# EAGLE design test#3 (EAGLE 9.6.2)
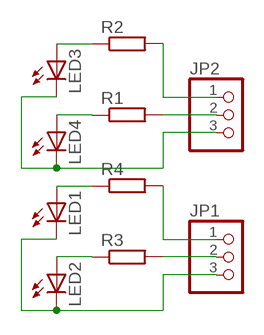
[diagram p0: schematic, sheet 1]

## Parts
JP1  PINHD-1X3  [1X03]
JP2  PINHD-1X3  [1X03]
LED1  LED3MM  [LED3MM]
LED2  LED3MM  [LED3MM]
LED3  LED3MM  [LED3MM]
LED4  LED3MM  [LED3MM]
R1  R-EU_0204/7  [0204/7]
R2  R-EU_0204/7  [0204/7]
R3  R-EU_0204/7  [0204/7]
R4  R-EU_0204/7  [0204/7]

## Nets
N$1: JP1.1 R4.2
N$2: JP1.2 R3.2
N$3: LED1.A R4.1
N$4: LED2.A R3.1
N$5: JP2.1 R2.2
N$6: JP1.3 LED1.K(C) LED2.K(C)
N$7: LED3.A R2.1
N$8: JP2.3 LED3.K(C) LED4.K(C)
N$9: JP2.2 R1.2
N$10: LED4.A R1.1

## Library data of the parts
JP1 JP2 = adafruit:PINHD-1X3: PIN HEADER
LED1-LED4 = adafruit:LED: LED OSRAM: - CHIPLED LG R971, LG N971, LY N971, LG Q971, LY Q971, LO R971, LY R971 LH N974, LH R974 LS Q976, LO Q976, LY Q976 LO Q996 - Hyper CHIPLED LW Q18S LB Q993, LB Q99A, LB R99A - SideLED LS A670, LO A670, LY A670, LG A670, LP A670 LB A673, LV A673, LT A673, LW A673 LH A674 LY A675 LS A676, LA A676, LO A676, LY A676, LW A676 LS A679, LY A679, LG A679 - Hyper Micro SIDELED® LS Y876, LA Y876, LO Y876, LY Y876 LT Y87S - SmartLED LW L88C, LW L88S LB L89C, LB L89S, LG L890 LS L89K, LO L89K, LY L89K LS L896, LA L896, LO L896, LY L896 - TOPLED LS T670, LO T670, LY T670, LG T670, LP T670 LSG T670, LSP T670, LSY T670, LOP T670, LYG T670 LG T671, LOG T671, LSG T671 LB T673, LV T673, LT T673, LW T673 LH T674 LS T676, LA T676, LO T676, LY T676, LB T676, LH T676, LSB T676, LW T676 LB T67C, LV T67C, LT T67C, LS T67K, LO T67K, LY T67K, LW E67C LS E67B, LA E67B, LO E67B, LY E67B, LB E67C, LV E67C, LT E67C LW T67C LS T679, LY T679, LG T679 LS T770, LO T770, LY T770, LG T770, LP T770 LB T773, LV T773, LT T773, LW T773 LH T774 LS E675, LA E675, LY E675, LS T675 LS T776, LA T776, LO T776, LY T776, LB T776 LHGB T686 LT T68C, LB T68C - Hyper Mini TOPLED® LB M676 - Mini TOPLED Santana® LG M470 LS M47K, LO M47K, LY M47K Source: http://www.osram.convergy.de/
R1-R4 = rcl:R-EU_: RESISTOR, European symbol; SPICEPREFIX: R

## Board
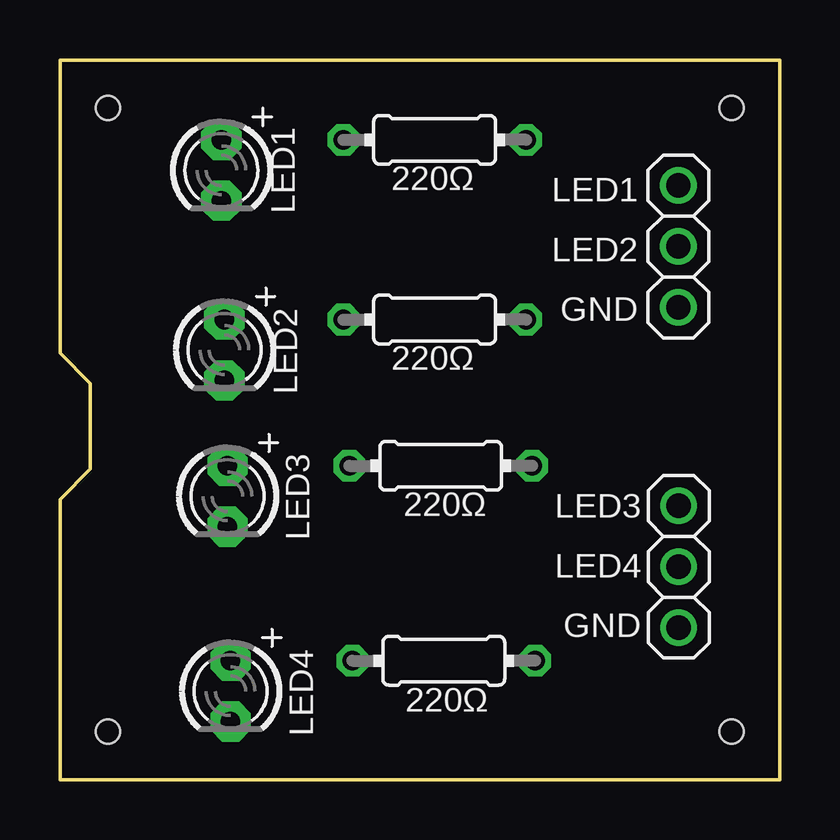
[diagram p1: board, top side]
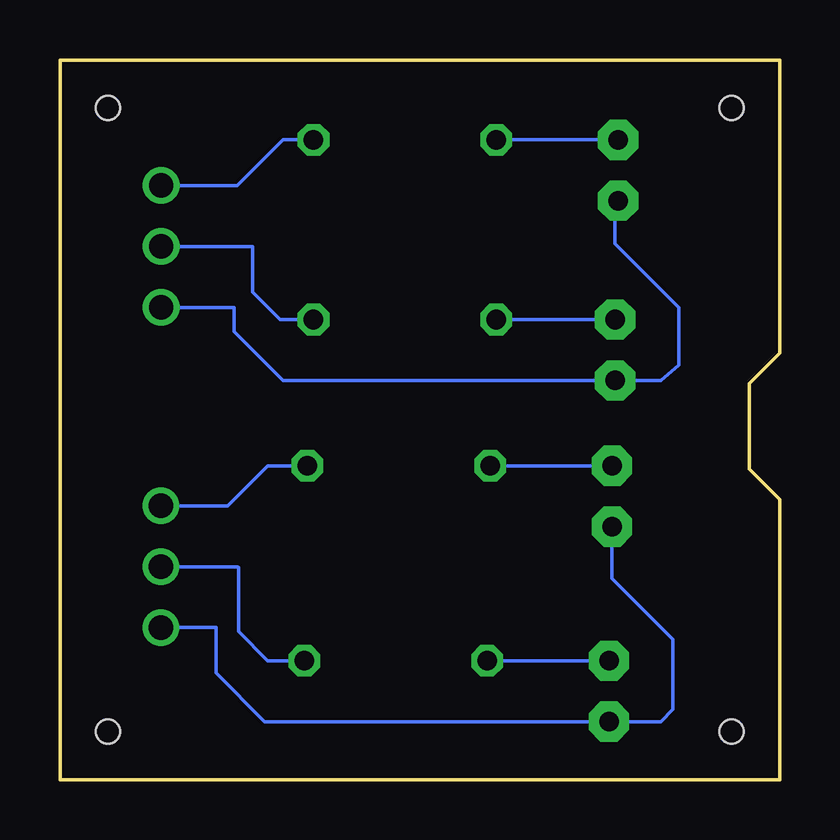
[diagram p2: board, bottom side, seen from below]

Size 30 x 30 mm. Coordinates in mm from the lower left corner, seen from the top.
Outline: 30,0 0,0 0,11.68 1.27,12.95 1.27,16.51 0,17.78 0,30 30,30 30,0
Copper layers (1*16): Top 0.035mm / dielectric 1.5mm / Bottom 0.035mm
Design rules "default": minimum track width 6mil, minimum drill 0.35mm, track to track 6mil, track to pad 6mil, pad to pad 6mil, via to via 6mil, smd to smd 6mil, copper to edge 40mil, drill to drill 6mil, minimum pad ring 10mil, minimum via ring 8mil, stop-mask expansion 4mil, vias tented up to drill 0mil, thermal gap 10mil
Holes 1 mm at 2,28 2,2 28,28 28,2

### Footprints (pad centres in the part's own frame; a part is rotated, then mirrored left to right if it is on the bottom)
1X03 = drill 1.016: 1 -2.54,0; 2 0,0; 3 2.54,0
LED3MM = drill 0.813 pad 1.676 octagon: A -1.27,0; K 1.27,0
0204/7 = drill 0.813 octagon: 1 -3.81,0; 2 3.81,0

### Placement (x,y rotation side)
JP1  25.8,8.87 270 top
JP2  25.78,22.23 270 top
LED1  6.99,11.81 270 top
LED2  7.11,3.68 270 top
LED3  6.73,25.4 270 top
LED4  6.86,17.91 270 top
R1  15.62,19.18 0 top
R2  15.62,26.67 0 top
R3  16,4.95 0 top
R4  15.88,13.08 0 top

### Tracks (layer width: path | path; a pad name or v marks a point on that pad's centre or on a via)
N$1
  Bottom 0.152: R4.2 21.34,13.08 23,11.41 JP1.1
N$2
  Bottom 0.152: R3.2 21.34,4.95 22.55,6.17 22.55,8.84 22.59,8.87 JP1.2
N$3
  Bottom 0.152: R4.1 LED1.A
N$4
  Bottom 0.152: R3.1 LED2.A
N$5
  Bottom 0.152: JP2.1 22.61,24.77 20.7,26.67 R2.2
N$6
  Bottom 0.152: LED1.K 6.99,8.38 4.45,5.84 4.45,2.92 4.95,2.41 LED2.K | LED2.K 7.16,2.36 | LED2.K 21.46,2.41 23.5,4.45 23.5,6.33 JP1.3
N$7
  Bottom 0.152: R2.1 LED3.A
N$8
  Bottom 0.152: LED4.K 6.6,16.64 | LED4.K 20.7,16.64 22.73,18.67 22.73,19.68 JP2.3 | LED4.K 4.95,16.64 4.19,17.27 4.19,19.68 6.86,22.35 6.86,24.13 LED3.K
N$9
  Bottom 0.152: R1.2 20.83,19.18 21.97,20.32 21.97,22.23 JP2.2
N$10
  Bottom 0.152: LED4.A R1.1

### Text on the board
tNames: LED1 | 220Ω | LED1 / LED2 / GND | LED2 | 220Ω | LED3 | 220Ω | LED3 / LED4 / GND | LED4 | 220Ω